# EAGLE schematic FreqCount84 (EAGLE 6.6.0)

## Sheet 1 of 5: Microcontroller and Power Supply
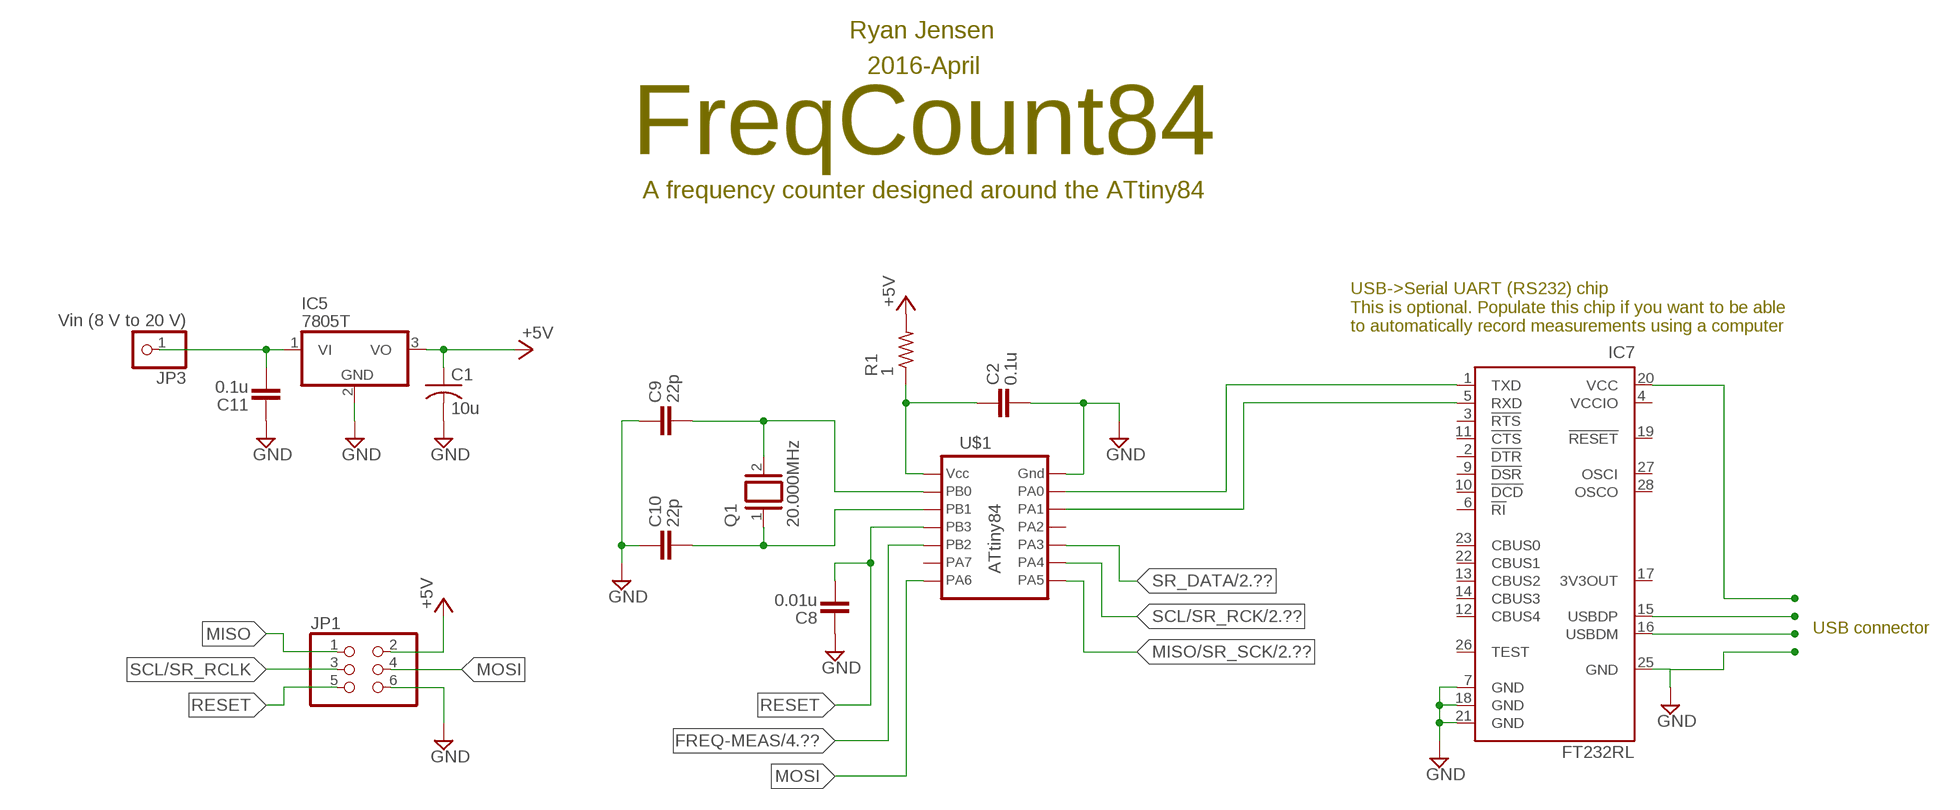
[diagram p0: schematic, sheet 1]

### Parts
C1  10u  C-US025-050X050  [C025-050X050]
C2  0.1u  C-EUC0603  [C0603]
C8  0.01u  C-EUC0603  [C0603]
C9  22p  C-EUC0603  [C0603]
C10  22p  C-EUC0603  [C0603]
C11  0.1u  C-EUC0603  [C0603]
IC5  7805T  [TO220H]
IC7  FT232RL  [SSOP28]
JP1  PINHD-2X3  [2X03]
JP3  Vin (8 V to 20 V)  PINHD-1X1  [1X01]
Q1  20.000MHz  XTAL/S  [QS]
R1  1  R-US_R0603  [R0603]
U$1  ATtiny84  ATTINY24ASO14  [SO14]

### Nets
+5V: C1.1 IC5.3(VO) JP1.2 R1.2 ; also sheet 2,4,5
FREQ-MEAS: U$1.5 ; also sheet 4
GND: C1.2 C2.2 C8.1 C9.1 C10.1 C11.1 IC5.2(GND) IC7.7(GND) IC7.18(GND) IC7.21(GND) IC7.25(GND) JP1.6 U$1.14 ; also sheet 2,3,4,5
MISO: JP1.1
MISO/SR_SCK: U$1.8 ; also sheet 2
MOSI: JP1.4 U$1.7
N$1: C9.2 Q1.2 U$1.2
N$2: C11.2 IC5.1(VI) JP3.1
N$3: C2.1 R1.1 U$1.1
N$9: C10.2 Q1.1 U$1.3
N$53: IC7.1(TXD) U$1.13
N$55: IC7.5(RXD) U$1.12
N$58: IC7.15(USBDP)
N$59: IC7.16(USBDM)
N$60: IC7.20(VCC)
RESET: C8.2 JP1.5 U$1.4
SCL/SR_RCK: U$1.9 ; also sheet 2
SCL/SR_RCLK: JP1.3
SR_DATA: U$1.10 ; also sheet 2
Unconnected: IC7.2(!DTR) IC7.3(!RTS) IC7.6(!RI) IC7.9(!DSR) IC7.10(!DCD) IC7.11(!CTS) IC7.12(CBUS4) IC7.13(CBUS2) IC7.14(CBUS3) IC7.17(3V3OUT) IC7.19(!RESET) IC7.22(CBUS1) IC7.23(CBUS0) IC7.26(TEST) IC7.27(OSCI) IC7.28(OSCO) U$1.6 U$1.11

### Notes on the sheet
- Ryan Jensen
- 2016-April
- FreqCount84
- A frequency counter designed around the ATtiny84
- USB->Serial UART (RS232) chip
  This is optional. Populate this chip if you want to be able
  to automatically record measurements using a computer
- USB connector

## Sheet 2 of 5: Shift Register Outputs to Display / User Interface / Frequency Division Selection
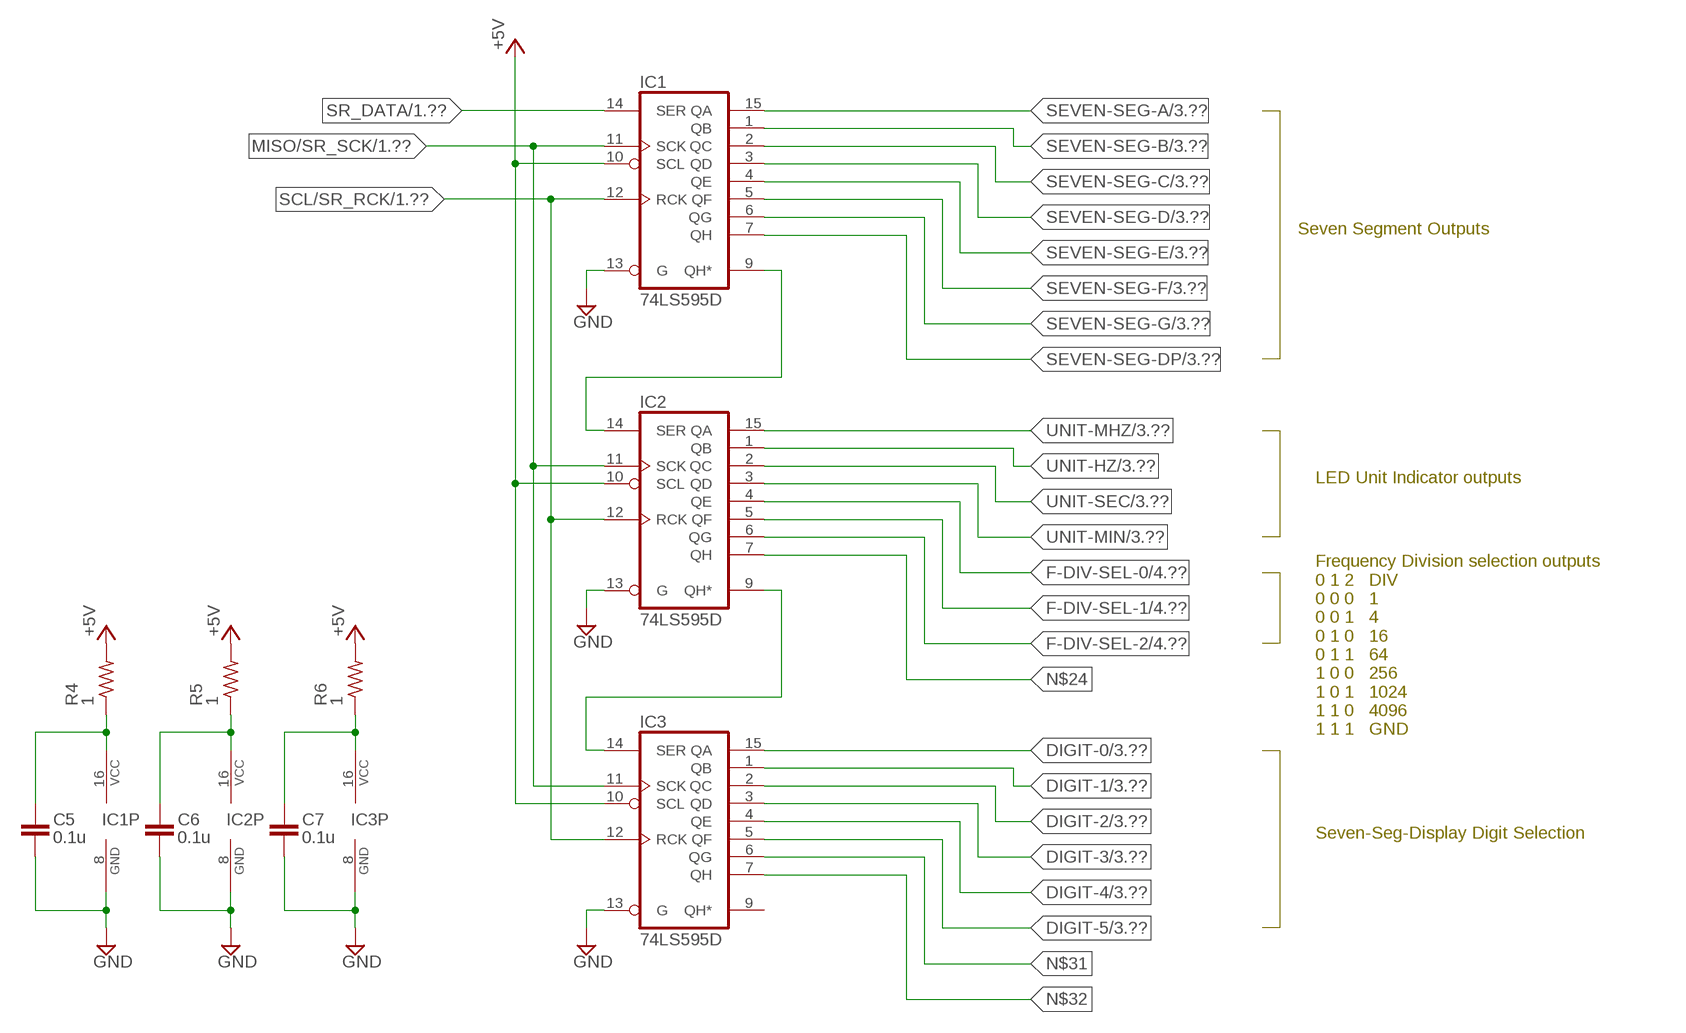
[diagram p1: schematic, sheet 2]

### Parts
C5  0.1u  C-EUC0603  [C0603]
C6  0.1u  C-EUC0603  [C0603]
C7  0.1u  C-EUC0603  [C0603]
IC1  74LS595D  [SO16]
IC2  74LS595D  [SO16]
IC3  74LS595D  [SO16]
R4  1  R-US_R0603  [R0603]
R5  1  R-US_R0603  [R0603]
R6  1  R-US_R0603  [R0603]

### Nets
+5V: IC1.10(SCL) IC2.10(SCL) IC3.10(SCL) R4.2 R5.2 R6.2 ; also sheet 1,4,5
DIGIT-0: IC3.15(QA) ; also sheet 3
DIGIT-1: IC3.1(QB) ; also sheet 3
DIGIT-2: IC3.2(QC) ; also sheet 3
DIGIT-3: IC3.3(QD) ; also sheet 3
DIGIT-4: IC3.4(QE) ; also sheet 3
DIGIT-5: IC3.5(QF) ; also sheet 3
F-DIV-SEL-0: IC2.4(QE) ; also sheet 4
F-DIV-SEL-1: IC2.5(QF) ; also sheet 4
F-DIV-SEL-2: IC2.6(QG) ; also sheet 4
GND: C5.2 C6.2 C7.2 IC1.8(GND) IC2.8(GND) IC2.13(G) IC3.8(GND) IC3.13(G) ; also sheet 1,3,4,5
MISO/SR_SCK: IC1.11(SCK) IC2.11(SCK) IC3.11(SCK) ; also sheet 1
N$4: IC1.13(G)
N$5: C5.1 IC1.16(VCC) R4.1
N$6: C6.1 IC2.16(VCC) R5.1
N$8: IC1.9(QH*) IC2.14(SER)
N$10: IC2.9(QH*) IC3.14(SER)
N$11: C7.1 IC3.16(VCC) R6.1
N$24: IC2.7(QH)
N$31: IC3.6(QG)
N$32: IC3.7(QH)
SCL/SR_RCK: IC1.12(RCK) IC2.12(RCK) IC3.12(RCK) ; also sheet 1
SEVEN-SEG-A: IC1.15(QA) ; also sheet 3
SEVEN-SEG-B: IC1.1(QB) ; also sheet 3
SEVEN-SEG-C: IC1.2(QC) ; also sheet 3
SEVEN-SEG-D: IC1.3(QD) ; also sheet 3
SEVEN-SEG-DP: IC1.7(QH) ; also sheet 3
SEVEN-SEG-E: IC1.4(QE) ; also sheet 3
SEVEN-SEG-F: IC1.5(QF) ; also sheet 3
SEVEN-SEG-G: IC1.6(QG) ; also sheet 3
SR_DATA: IC1.14(SER) ; also sheet 1
UNIT-HZ: IC2.1(QB) ; also sheet 3
UNIT-MHZ: IC2.15(QA) ; also sheet 3
UNIT-MIN: IC2.3(QD) ; also sheet 3
UNIT-SEC: IC2.2(QC) ; also sheet 3
Unconnected: IC3.9(QH*)

### Notes on the sheet
- Seven Segment Outputs
- LED Unit Indicator outputs
- Frequency Division selection outputs
  0 1 2   DIV
  0 0 0   1
  0 0 1   4
  0 1 0   16
  0 1 1   64
  1 0 0   256
  1 0 1   1024
  1 1 0   4096
  1 1 1   GND
- Seven-Seg-Display Digit Selection

## Sheet 3 of 5: Connections to the seven-segment display
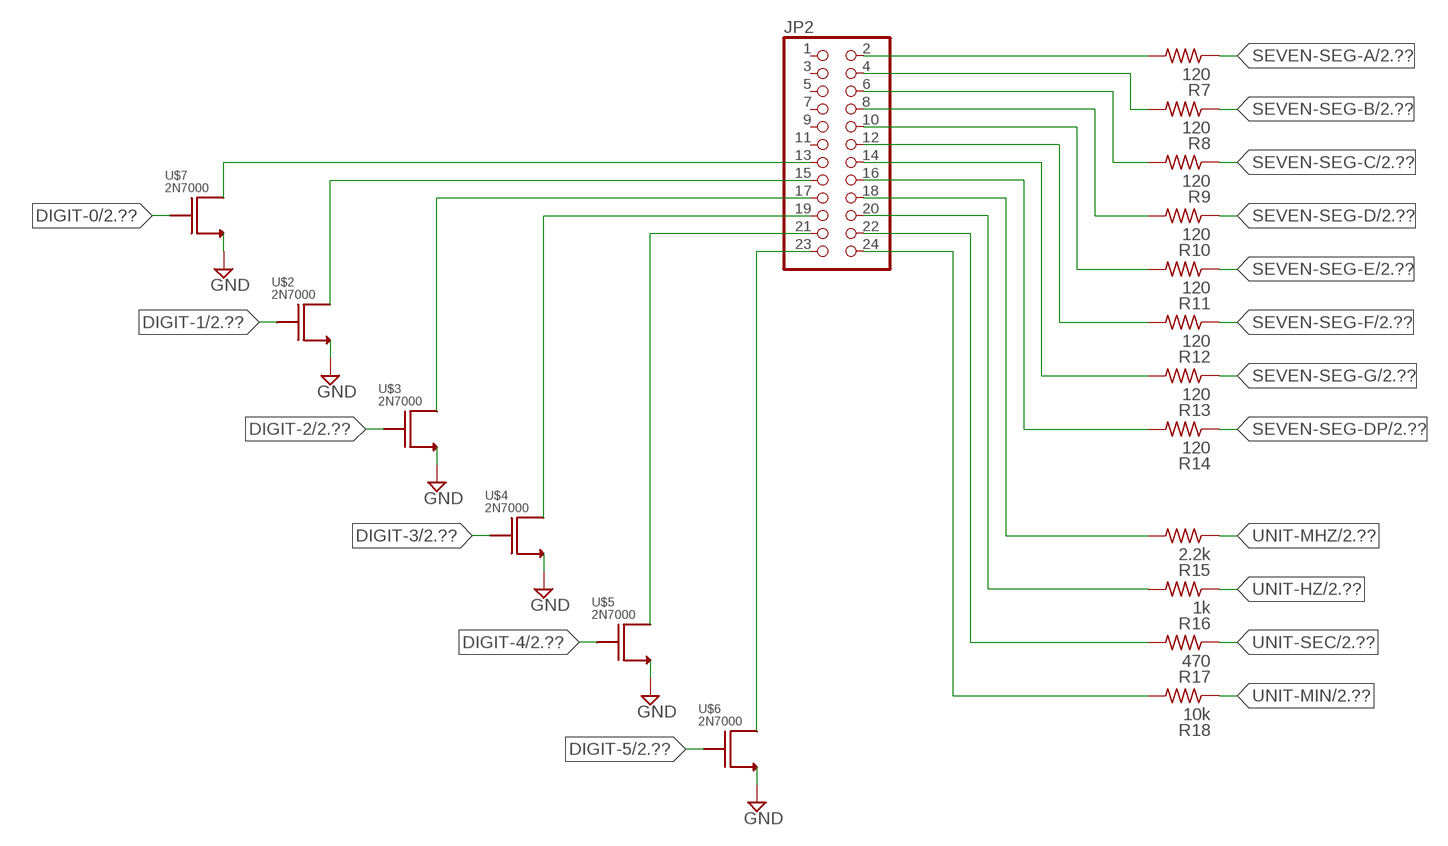
[diagram p2: schematic, sheet 3]

### Parts
JP2  PINHD-2X12  [2X12]
R7  120  R-US_R0603  [R0603]
R8  120  R-US_R0603  [R0603]
R9  120  R-US_R0603  [R0603]
R10  120  R-US_R0603  [R0603]
R11  120  R-US_R0603  [R0603]
R12  120  R-US_R0603  [R0603]
R13  120  R-US_R0603  [R0603]
R14  120  R-US_R0603  [R0603]
R15  2.2k  R-US_R0603  [R0603]
R16  1k  R-US_R0603  [R0603]
R17  470  R-US_R0603  [R0603]
R18  10k  R-US_R0603  [R0603]
U$2  2N7000  [2N7000]
U$3  2N7000  [2N7000]
U$4  2N7000  [2N7000]
U$5  2N7000  [2N7000]
U$6  2N7000  [2N7000]
U$7  2N7000  [2N7000]

### Nets
DIGIT-0: U$7.G ; also sheet 2
DIGIT-1: U$2.G ; also sheet 2
DIGIT-2: U$3.G ; also sheet 2
DIGIT-3: U$4.G ; also sheet 2
DIGIT-4: U$5.G ; also sheet 2
DIGIT-5: U$6.G ; also sheet 2
GND: U$2.S U$3.S U$4.S U$5.S U$6.S U$7.S ; also sheet 1,2,4,5
N$13: JP2.13 U$7.D
N$14: JP2.15 U$2.D
N$15: JP2.17 U$3.D
N$16: JP2.19 U$4.D
N$17: JP2.21 U$5.D
N$18: JP2.23 U$6.D
N$19: JP2.2 R7.2
N$20: JP2.4 R8.2
N$25: JP2.6 R9.2
N$26: JP2.8 R10.2
N$27: JP2.10 R11.2
N$28: JP2.12 R12.2
N$29: JP2.14 R13.2
N$30: JP2.16 R14.2
N$33: JP2.18 R15.2
N$34: JP2.20 R16.2
N$35: JP2.22 R17.2
N$36: JP2.24 R18.2
SEVEN-SEG-A: R7.1 ; also sheet 2
SEVEN-SEG-B: R8.1 ; also sheet 2
SEVEN-SEG-C: R9.1 ; also sheet 2
SEVEN-SEG-D: R10.1 ; also sheet 2
Unconnected: JP2.1 JP2.3 JP2.5 JP2.7 JP2.9 JP2.11 R11.1 R12.1 R13.1 R14.1 R15.1 R16.1 R17.1 R18.1

## Sheet 4 of 5: Digital Frequency Divider
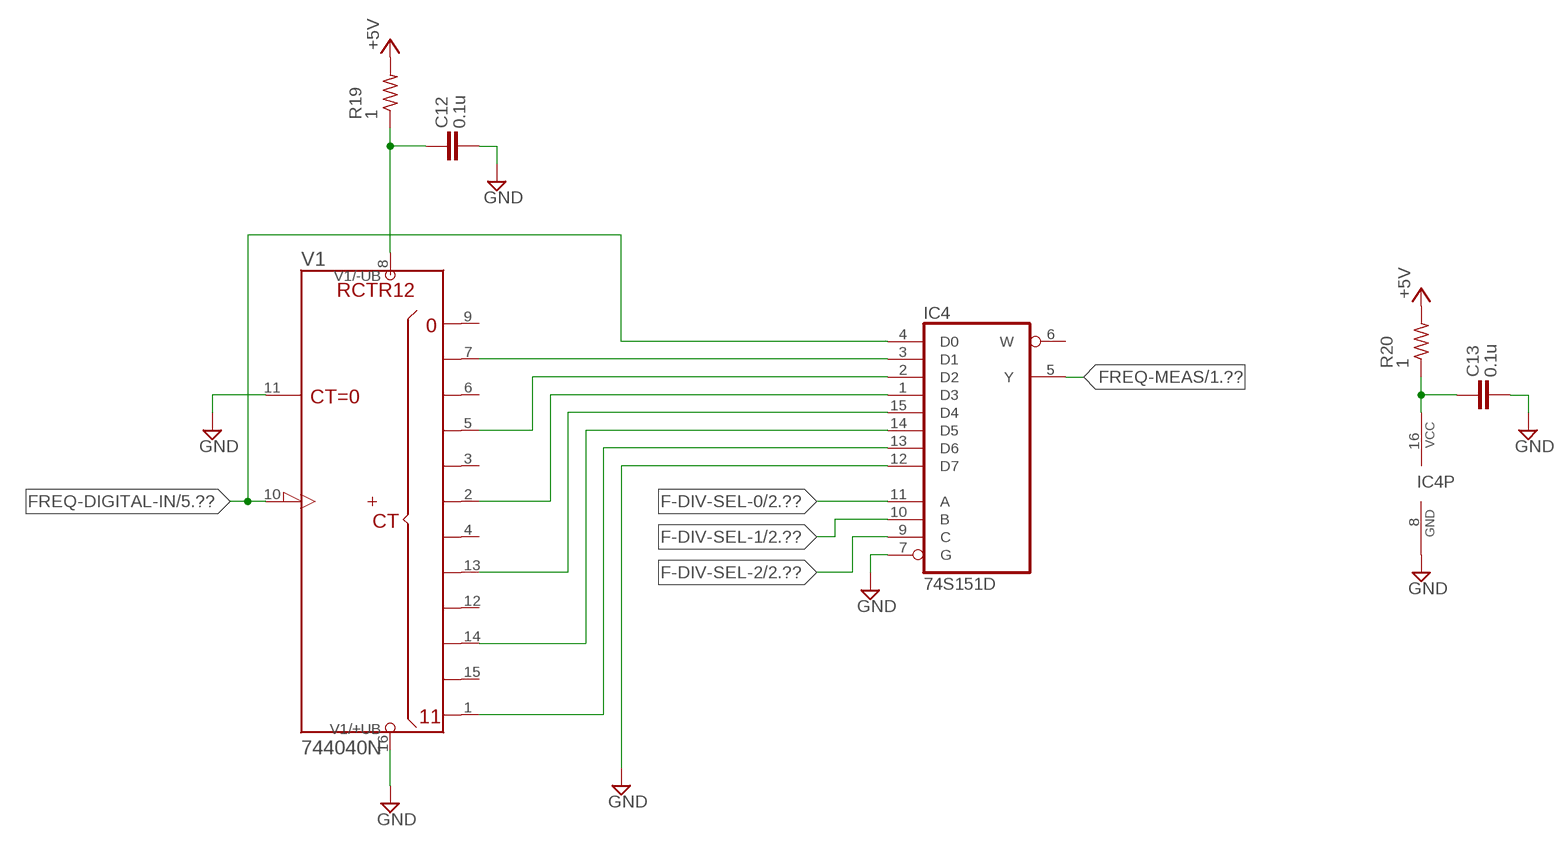
[diagram p3: schematic, sheet 4]

### Parts
C12  0.1u  C-EUC0603  [C0603]
C13  0.1u  C-EUC0603  [C0603]
IC4  74S151D  [SO16]
R19  1  R-US_R0603  [R0603]
R20  1  R-US_R0603  [R0603]
V1  744040N  [DIL16]

### Nets
+5V: R19.2 R20.2 ; also sheet 1,2,5
F-DIV-SEL-0: IC4.11(A) ; also sheet 2
F-DIV-SEL-1: IC4.10(B) ; also sheet 2
F-DIV-SEL-2: IC4.9(C) ; also sheet 2
FREQ-DIGITAL-IN: IC4.4(D0) V1.10(CLK) ; also sheet 5
FREQ-MEAS: IC4.5(Y) ; also sheet 1
GND: C12.2 C13.2 IC4.7(G) IC4.8(GND) IC4.12(D7) V1.11(CLR) V1.16(+UB) ; also sheet 1,2,3,5
N$7: IC4.3(D1) V1.7(QB)
N$12: IC4.15(D4) V1.13(QH)
N$21: C12.1 R19.1 V1.8(-UB)
N$37: C13.1 IC4.16(VCC) R20.1
N$38: IC4.2(D2) V1.5(QD)
N$39: IC4.1(D3) V1.2(QF)
N$40: IC4.14(D5) V1.14(QJ)
N$41: IC4.13(D6) V1.1(QL)
Unconnected: IC4.6(W) V1.3(QE) V1.4(QG) V1.6(QC) V1.9(QA) V1.12(QI) V1.15(QK)

## Sheet 5 of 5: Signal Input Stage AC / DC Coupling and Amplification
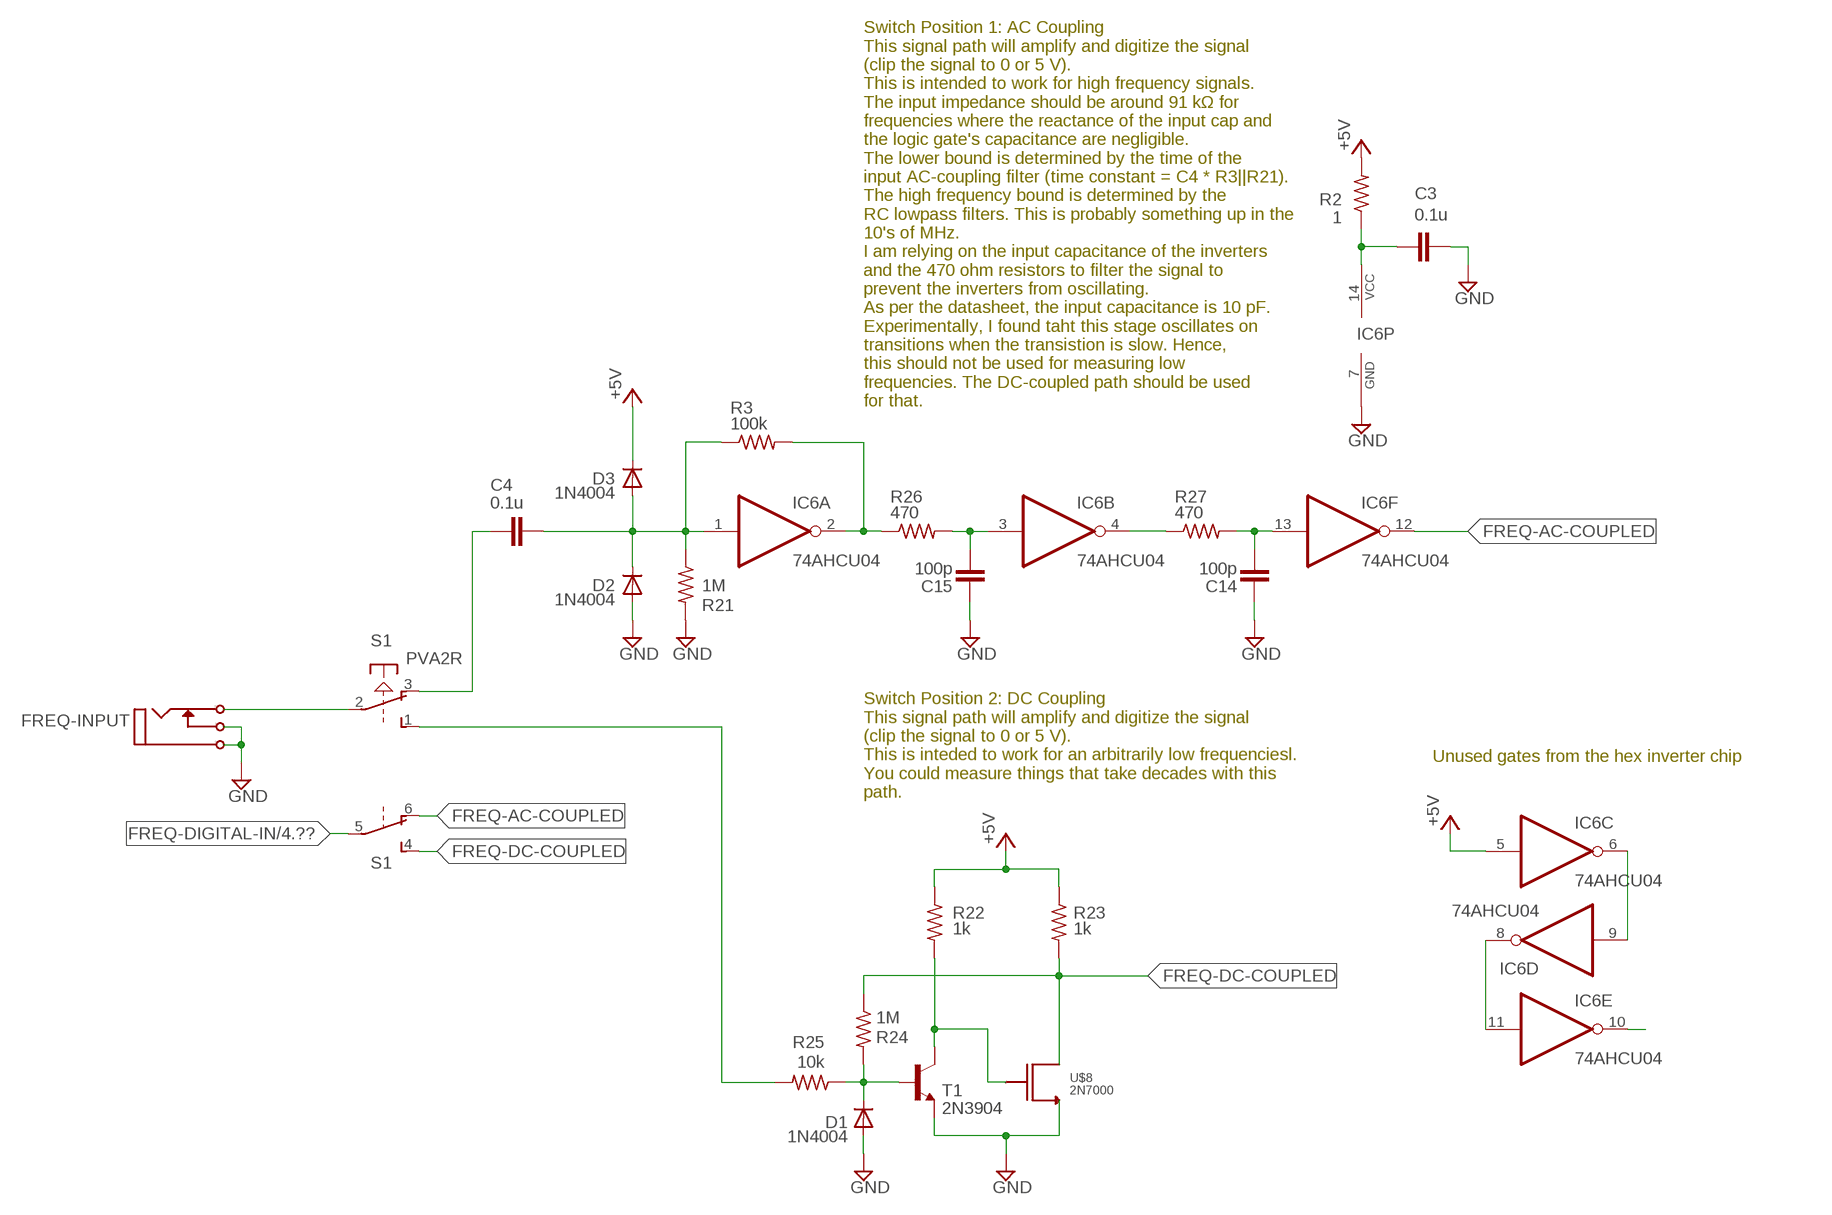
[diagram p4: schematic, sheet 5]

### Parts
C3  0.1u  C-EUC0603  [C0603]
C4  0.1u  C-EUC0603  [C0603]
C14  100p  C-EUC0603  [C0603]
C15  100p  C-EUC0603  [C0603]
D1  1N4004  [DO41-10]
D2  1N4004  [DO41-10]
D3  1N4004  [DO41-10]
FREQ-INPUT  I/O  MONO_JACK  [MONO_JACK]
IC6  74AHCU04  74ALS04D  [SO14]
R2  1  R-US_R0603  [R0603]
R3  100k  R-US_R0603  [R0603]
R21  1M  R-US_R0603  [R0603]
R22  1k  R-US_R0603  [R0603]
R23  1k  R-US_R0603  [R0603]
R24  1M  R-US_R0603  [R0603]
R25  10k  R-US_R0603  [R0603]
R26  470  R-US_R0603  [R0603]
R27  470  R-US_R0603  [R0603]
S1  PVA2R  [PVA2R]
T1  2N3904  [TO92]
U$8  2N7000  [2N7000]

### Nets
+5V: D3.C IC6.5(C:I) R2.2 R22.1 R23.1 ; also sheet 1,2,4
FREQ-AC-COUPLED: IC6.12(F:O) S1.6(2:O)
FREQ-DC-COUPLED: R23.2 R24.1 S1.4(2:S) U$8.D
FREQ-DIGITAL-IN: S1.5(2:P) ; also sheet 4
GND: C3.2 C14.1 C15.1 D1.A D2.A FREQ-INPUT.P$1 FREQ-INPUT.P$3(P3) IC6.7(P:GND) R21.2 T1.3(E) U$8.S ; also sheet 1,2,3,4
N$22: IC6.2(A:O) R3.2 R26.1
N$23: C15.2 IC6.3(B:I) R26.2
N$42: C14.2 IC6.13(F:I) R27.2
N$43: IC6.4(B:O) R27.1
N$44: IC6.6(C:O) IC6.9(D:I)
N$45: C3.1 IC6.14(P:VCC) R2.1
N$46: R22.2 T1.1(C) U$8.G
N$47: C4.1 S1.3(1:O)
N$48: IC6.8(D:O) IC6.11(E:I)
N$49: R25.2 S1.1(1:S)
N$50: FREQ-INPUT.P$2(P2) S1.2(1:P)
N$51: IC6.10(E:O)
N$52: C4.2 D2.C D3.A IC6.1(A:I) R3.1 R21.1
N$54: D1.C R24.2 R25.1 T1.2(B)

### Notes on the sheet
- Switch Position 1: AC Coupling
  This signal path will amplify and digitize the signal
  (clip the signal to 0 or 5 V).
  This is intended to work for high frequency signals.
  The input impedance should be around 91 kΩ for
  frequencies where the reactance of the input cap and
  the logic gate's capacitance are negligible.
  The lower bound is determined by the time of the
  input AC-coupling filter (time constant = C4 * R3||R21).
  The high frequency bound is determined by the
  RC lowpass filters. This is probably something up in the
  10's of MHz.
  I am relying on the input capacitance of the inverters
  and the 470 ohm resistors to filter the signal to
  prevent the inverters from oscillating.
  As per the datasheet, the input capacitance is 10 pF.
  Experimentally, I found taht this stage oscillates on
  transitions when the transistion is slow. Hence,
  this should not be used for measuring low
  frequencies. The DC-coupled path should be used
  for that.
- Unused gates from the hex inverter chip
- Switch Position 2: DC Coupling
  This signal path will amplify and digitize the signal
  (clip the signal to 0 or 5 V).
  This is inteded to work for an arbitrarily low frequenciesl.
  You could measure things that take decades with this
  path.

## Power pins joined to a net without a drawn wire
VCCIO: IC7.4(VCCIO)

## Library data of the parts
C1 = rcl:C-US: CAPACITOR, American symbol
C2-C15 = rcl:C-EU: CAPACITOR, European symbol
D1-D3 = diode:1N4004: DIODE general purpose rectifier, 1 A
FREQ-INPUT = !synth_sch:MONO_JACK
IC1-IC3 = 74xx-us:74*595: 8-bit SHIFT REGISTER, output latch
IC4 = 74xx-us:74*151: Data SELECTOR/MULTIPLEXER
IC5 = linear:78*: Positive VOLTAGE REGULATOR Source: http://cache.national.com/ds/LM/LM78L05.pdf http://www.fairchildsemi.com/ds/LM/LM7805.pdf
IC6 = 74xx-us:74*04: Hex INVERTER
IC7 = ftdichip:FT232R: Source: http://www.ftdichip.com/Documents/DataSheets/DS_FT232R_v104.pdf; MPN: FT232RL; OC_FARNELL: 1146032; OC_NEWARK: 91K9918
JP1 = pinhead:PINHD-2X3: PIN HEADER
JP2 = pinhead:PINHD-2X12: PIN HEADER
JP3 = pinhead:PINHD-1X1: PIN HEADER
Q1 = special:XTAL/S: CRYSTAL
R1-R27 = rcl:R-US_: RESISTOR, American symbol
S1 = switch-misc:PVA2R: ITT SWITCH
T1 = transistor:2N3904: NPN TRANSISTOR
U$1 = !ATtiny24A:ATTINY24A
U$2-U$8 = !synth_sch:2N7000
V1 = 74ttl-din:74*4040: 12-bit asynchronous binary COUNTER